# EAGLE board Ambisonic Clock Decoder With Phase Shifted Crosstalk Cancellation (EAGLE 9.0.1), part 1 of 2
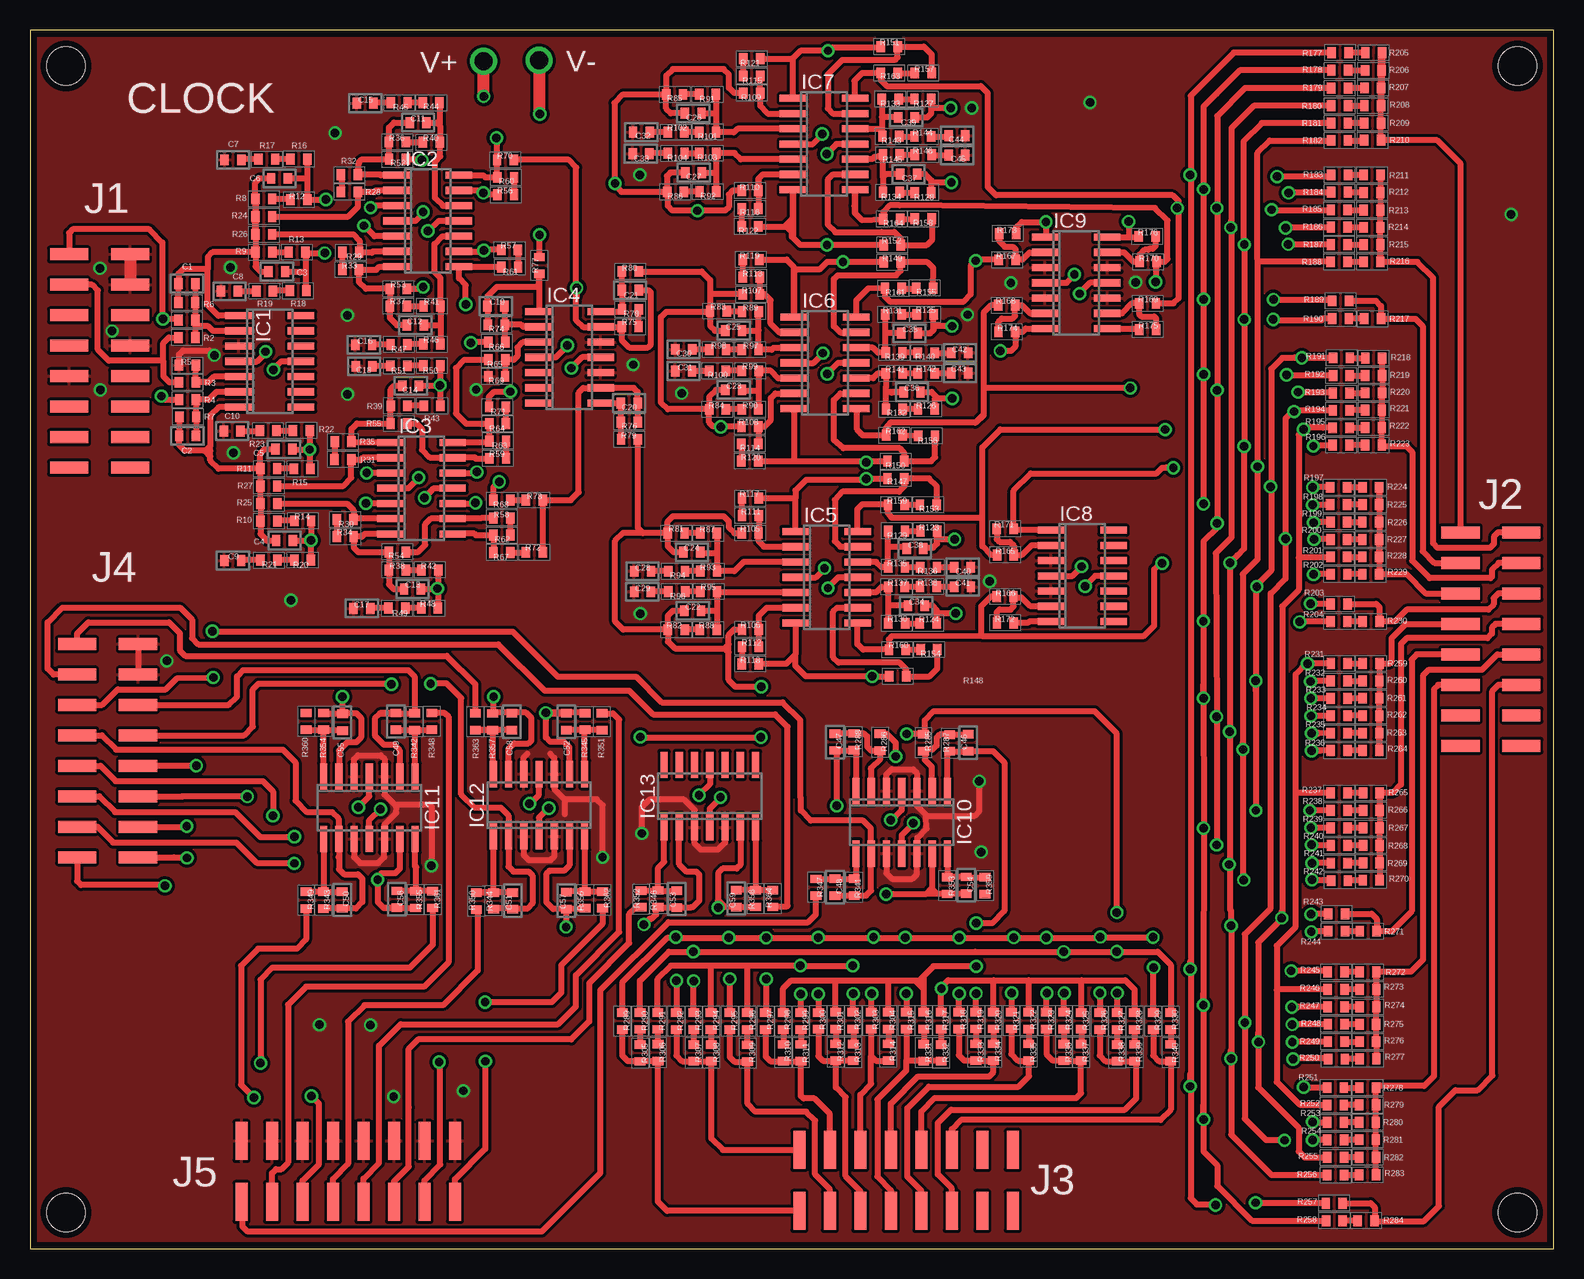
[diagram p5: board, top side]
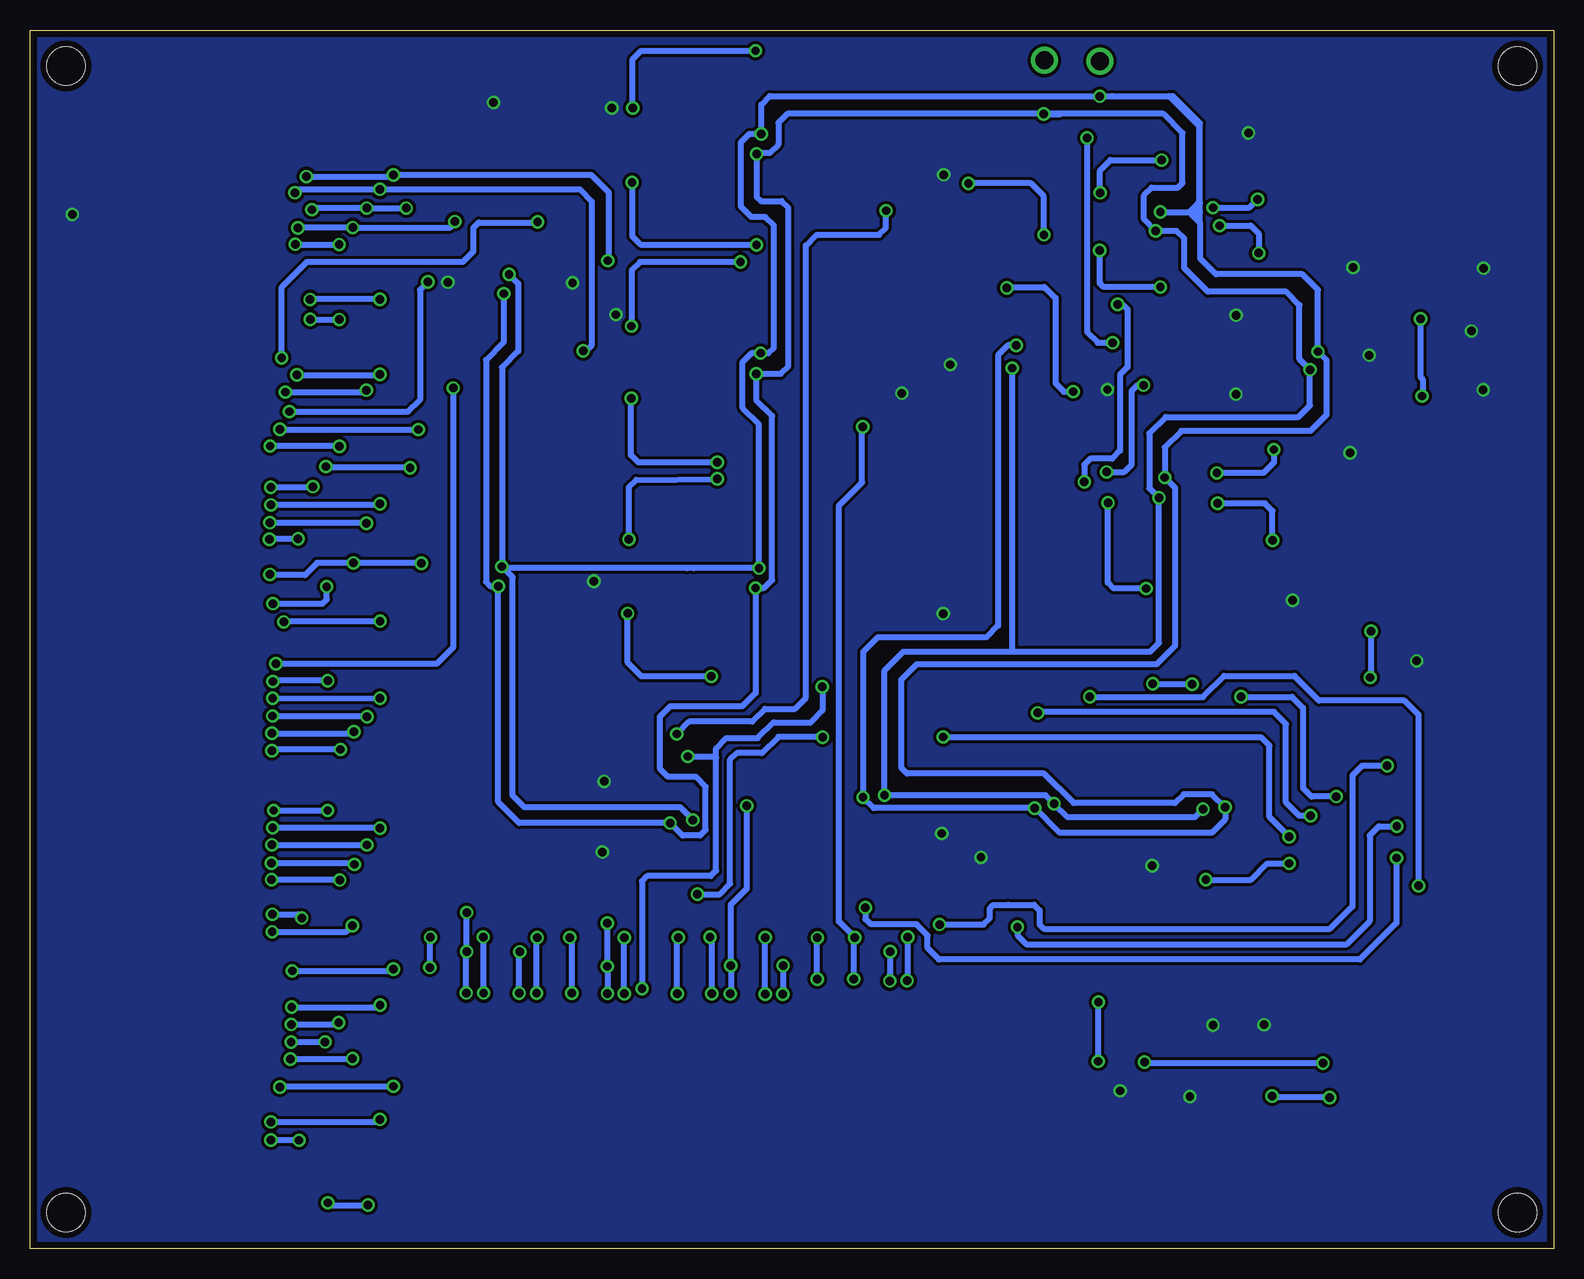
[diagram p6: board, bottom side, seen from below]

Size 127 x 101.6 mm. Coordinates in mm from the lower left corner, seen from the top.
Outline: 0,0 127,0 127,101.6 0,101.6 0,0
Copper layers (1*16): Top 0.035mm / dielectric 1.5mm / Bottom 0.035mm
Design rules "default *": minimum track width 6mil, minimum drill 0.35mm, track to track 10mil, track to pad 15mil, pad to pad 15mil, via to via 10mil, smd to smd 6mil, copper to edge 20mil, drill to drill 10mil, minimum pad ring 10mil, minimum via ring 8mil, stop-mask expansion 4mil, vias tented up to drill 0mil, thermal gap 10mil
Holes 3.2 mm at 3,98.6 124,98.6 3,3 124,3

## Footprints (pad centres in the part's own frame; a part is rotated, then mirrored left to right if it is on the bottom)
CT6032 = smd 0.7 x 0.9: + -0.7,0; - 0.7,0
SO14 = smd 0.6 x 2.2: 1 -3.81,-2.6; 2 -2.54,-2.6; 3 -1.27,-2.6; 4 0,-2.6; 5 1.27,-2.6; 6 2.54,-2.6; 7 3.81,-2.6; 8 3.81,2.6; 9 2.54,2.6; 10 1.27,2.6; 11 0,2.6; 12 -1.27,2.6; 13 -2.54,2.6; 14 -3.81,2.6
2X08SMT = smd 1 x 3.17: 1 -8.89,-2.54; 2 -8.89,2.54; 3 -6.35,-2.54; 4 -6.35,2.54; 5 -3.81,-2.54; 6 -3.81,2.54; 7 -1.27,-2.54; 8 -1.27,2.54; 9 1.27,-2.54; 10 1.27,2.54; 11 3.81,-2.54; 12 3.81,2.54; 13 6.35,-2.54; 14 6.35,2.54; 15 8.89,-2.54; 16 8.89,2.54
R6332W = smd 0.7 x 0.9: 1 -0.7,0; 2 0.7,0

## Placement (x,y rotation side)
C1  18PF  [CT6032]  13.09,80.46 180 top
C2  18PF  [CT6032]  13.14,67.77 180 top
C3  100NF  [CT6032]  20.57,81.45 0 top
C4  100NF  [CT6032]  21.22,59.03 0 top
C5  100NF  [CT6032]  21.16,66.65 0 top
C6  100NF  [CT6032]  20.8,89.23 0 top
C7  100NF  [CT6032]  16.92,90.77 0 top
C8  100NF  [CT6032]  16.63,79.82 0 top
C9  100NF  [CT6032]  16.9,57.37 0 top
C10  100NF  [CT6032]  16.85,68.16 0 top
C11  4.7NF  [CT6032]  32.35,93.88 0 top
C12  4.7NF  [CT6032]  32.12,76.99 0 top
C13  4.7NF  [CT6032]  31.89,54.99 0 top
C14  4.7NF  [CT6032]  31.73,71.94 0 top
C15  4.7NF  [CT6032]  27.94,95.49 0 top
C16  4.7NF  [CT6032]  27.82,75.35 0 top
C17  4.7NF  [CT6032]  27.66,53.38 0 top
C18  4.7NF  [CT6032]  27.85,73.56 0 top
C19  18PF  [CT6032]  38.84,78.58 180 top
C20  18PF  [CT6032]  49.95,70.49 180 top
C21  18PF  [CT6032]  50.04,79.9 180 top
C22  100NF  [CT6032]  55.24,53.19 0 top
C23  100NF  [CT6032]  58.65,71.6 0 top
C24  100NF  [CT6032]  55.17,58.07 0 top
C25  100NF  [CT6032]  58.65,76.53 0 top
C26  100NF  [CT6032]  55.28,94.65 0 top
C27  100NF  [CT6032]  55.31,89.71 0 top
C28  100NF  [CT6032]  51.07,56.48 180 top
C29  100NF  [CT6032]  51.06,54.77 180 top
C30  100NF  [CT6032]  54.5,74.97 180 top
C31  100NF  [CT6032]  54.49,73.17 180 top
C32  100NF  [CT6032]  50.97,93.08 180 top
C33  100NF  [CT6032]  50.94,91.28 180 top
C34  4.7NF  [CT6032]  73.89,53.6 180 top
C35  4.7NF  [CT6032]  73.32,76.32 180 top
C36  4.7NF  [CT6032]  73.53,71.42 180 top
C37  4.7NF  [CT6032]  73.25,89.58 180 top
C38  4.7NF  [CT6032]  73.77,58.37 180 top
C39  4.7NF  [CT6032]  73.06,94.31 180 top
C40  4.7NF  [CT6032]  77.73,56.81 0 top
C41  4.7NF  [CT6032]  77.74,55.18 0 top
C42  4.7NF  [CT6032]  77.5,74.69 0 top
C43  4.7NF  [CT6032]  77.5,72.99 0 top
C44  4.7NF  [CT6032]  77.27,92.79 0 top
C45  4.7NF  [CT6032]  77.27,91.16 0 top
C46  18PF  [CT6032]  78.2,42.19 270 top
C47  18PF  [CT6032]  67.11,42.24 270 top
C48  18PF  [CT6032]  67.11,30.14 90 top
C49  18PF  [CT6032]  30.5,43.96 270 top
C50  18PF  [CT6032]  26.03,29.07 90 top
C51  18PF  [CT6032]  40.24,29 90 top
C52  18PF  [CT6032]  44.7,43.94 270 top
C53  18PF  [CT6032]  53.92,29.15 90 top
C54  18PF  [CT6032]  78.04,30.3 90 top
C55  18PF  [CT6032]  26.05,43.89 270 top
C56  18PF  [CT6032]  30.58,29.13 90 top
C57  18PF  [CT6032]  44.7,29.01 90 top
C58  18PF  [CT6032]  40.17,43.94 270 top
C59  18PF  [CT6032]  58.88,29.19 90 top
IC1  TL074D  [SO14]  19.99,73.97 270 top
IC2  TL074D  [SO14]  33.15,85.68 270 top
IC3  TL074D  [SO14]  32.63,63.4 270 top
IC4  TL074D  [SO14]  44.97,74.31 270 top
IC5  TL074D  [SO14]  66.41,55.97 270 top
IC6  TL074D  [SO14]  66.27,73.85 270 top
IC7  TL074D  [SO14]  66.19,92.09 270 top
IC8  TL074D  [SO14]  87.72,56.09 270 top
IC9  TL074D  [SO14]  87.2,80.52 270 top
IC10  TL074D  [SO14]  72.66,35.55 180 top
IC11  TL074D  [SO14]  28.29,36.76 180 top
IC12  TL074D  [SO14]  42.43,36.97 0 top
IC13  TL074D  [SO14]  56.67,37.73 0 top
J1  CON_16  [2X08SMT]  5.8,74.01 270 top
J2  CON_16  [2X08SMT]  121.79,50.82 270 top
J3  CON_16  [2X08SMT]  73.03,5.69 0 top
J4  CON_16  [2X08SMT]  6.46,41.52 270 top
J5  CON_16  [2X08SMT]  26.53,6.44 0 top
R1  10K  [R6332W]  13.08,77.42 0 top
R2  10K  [R6332W]  13.08,75.96 0 top
R3  10K  [R6332W]  13.13,72.23 0 top
R4  10K  [R6332W]  13.14,70.78 0 top
R5  R  [R6332W]  13.13,73.65 0 top
R6  10K  [R6332W]  13.07,78.87 180 top
R7  10K  [R6332W]  13.15,69.35 180 top
R8  R  [R6332W]  19.49,87.52 0 top
R9  R  [R6332W]  19.5,83.07 0 top
R10  R  [R6332W]  19.91,60.66 0 top
R11  10K  [R6332W]  19.9,65.03 0 top
R12  R  [R6332W]  22.41,87.45 0 top
R13  R  [R6332W]  22.26,83.08 0 top
R14  R  [R6332W]  22.74,60.69 0 top
R15  470R  [R6332W]  22.69,65.01 0 top
R16  22K  [R6332W]  22.41,90.84 0 top
R17  100R  [R6332W]  19.74,90.82 180 top
R18  8.2K  [R6332W]  22.35,79.86 0 top
R19  1.2K  [R6332W]  19.56,79.83 180 top
R20  22K  [R6332W]  22.73,57.41 0 top
R21  100R  [R6332W]  19.91,57.4 180 top
R22  8.2K  [R6332W]  22.63,68.21 0 top
R23  1.2K  [R6332W]  19.85,68.2 180 top
R24  10K  [R6332W]  19.49,86.05 0 top
R25  10K  [R6332W]  19.91,62.12 0 top
R26  10K  [R6332W]  19.49,84.56 0 top
R27  10K  [R6332W]  19.9,63.58 0 top
R28  39K  [R6332W]  26.63,88.1 180 top
R29  47K  [R6332W]  26.74,83.07 180 top
R30  39K  [R6332W]  26.27,60.79 180 top
R31  47K  [R6332W]  26.09,65.8 180 top
R32  390R  [R6332W]  26.63,89.53 0 top
R33  1K  [R6332W]  26.73,81.62 0 top
R34  390R  [R6332W]  26.28,59.36 0 top
R35  1K  [R6332W]  26.1,67.28 0 top
R36  6.8K  [R6332W]  30.63,92.26 0 top
R37  4.7K  [R6332W]  30.71,78.58 0 top
R38  6.8K  [R6332W]  30.63,56.59 0 top
R39  4.7K  [R6332W]  30.77,70.26 0 top
R40  5.1K  [R6332W]  33.46,92.24 0 top
R41  390R  [R6332W]  33.51,78.58 0 top
R42  5.1K  [R6332W]  33.33,56.59 0 top
R43  390R  [R6332W]  33.52,70.27 0 top
R44  10K  [R6332W]  33.44,95.53 0 top
R45  560R  [R6332W]  30.78,95.53 180 top
R46  2.2K  [R6332W]  33.5,75.4 0 top
R47  180R  [R6332W]  30.76,75.38 180 top
R48  10K  [R6332W]  33.31,53.4 0 top
R49  560R  [R6332W]  30.59,53.4 180 top
R50  2.2k  [R6332W]  33.5,73.62 0 top
R51  180R  [R6332W]  30.75,73.6 180 top
R52  10K  [R6332W]  30.64,90.82 0 top
R53  10K  [R6332W]  30.71,80.02 0 top
R54  10K  [R6332W]  30.63,58.09 0 top
R55  10K  [R6332W]  30.76,68.79 0 top
R56  47K  [R6332W]  39.65,87.86 0 top
R57  39K  [R6332W]  39.98,83.27 0 top
R58  47K  [R6332W]  39.33,60.92 0 top
R59  39K  [R6332W]  38.99,65.89 0 top
R60  820R  [R6332W]  39.65,89.31 180 top
R61  390R  [R6332W]  39.99,81.83 180 top
R62  820R  [R6332W]  39.33,59.49 180 top
R63  360R  [R6332W]  38.99,67.34 180 top
R64  5.6K  [R6332W]  38.98,68.78 0 top
R65  10K  [R6332W]  38.91,74.13 0 top
R66  24K  [R6332W]  38.91,75.57 0 top
R67  560R  [R6332W]  39.34,58.05 0 top
R68  6.8K  [R6332W]  39.33,62.4 0 top
R69  15K  [R6332W]  38.9,72.72 0 top
R70  10K  [R6332W]  39.64,90.77 0 top
R71  56K  [R6332W]  38.97,70.19 180 top
R72  12K  [R6332W]  42.04,58.06 0 top
R73  47K  [R6332W]  42.04,62.41 0 top
R74  10K  [R6332W]  38.88,77.02 180 top
R75  4.7K  [R6332W]  50.03,76.86 0 top
R76  10K  [R6332W]  49.96,68.92 180 top
R77  47R  [R6332W]  42.45,81.96 90 top
R78  270R  [R6332W]  50.05,78.31 180 top
R79  47R  [R6332W]  49.97,67.47 0 top
R80  47R  [R6332W]  50.04,81.47 0 top
R81  47K  [R6332W]  53.86,59.65 0 top
R82  10K  [R6332W]  53.88,51.6 0 top
R83  47K  [R6332W]  57.39,78.16 0 top
R84  10K  [R6332W]  57.31,69.98 0 top
R85  47K  [R6332W]  53.74,96.23 0 top
R86  10K  [R6332W]  53.81,88.1 0 top
R87  220R  [R6332W]  56.56,59.65 0 top
R88  470R  [R6332W]  56.54,51.6 0 top
R89  220R  [R6332W]  60.05,78.13 0 top
R90  470R  [R6332W]  60.02,69.98 0 top
R91  220R  [R6332W]  56.48,96.24 0 top
R92  470R  [R6332W]  56.51,88.12 0 top
R93  47K  [R6332W]  56.57,56.49 0 top
R94  22K  [R6332W]  53.9,56.48 180 top
R95  8.2K  [R6332W]  56.57,54.79 0 top
R96  1.2K  [R6332W]  53.91,54.79 180 top
R97  47K  [R6332W]  60.03,74.95 0 top
R98  22K  [R6332W]  57.32,74.95 180 top
R99  8.2K  [R6332W]  60.04,73.19 0 top
R100  1.2K  [R6332W]  57.31,73.18 180 top
R101  47K  [R6332W]  56.49,93.09 0 top
R102  22K  [R6332W]  53.85,93.08 180 top
R103  8.2K  [R6332W]  56.5,91.33 0 top
R104  1.2K  [R6332W]  53.86,91.32 180 top
R105  10K  [R6332W]  60.03,59.66 0 top
R106  10K  [R6332W]  60.05,51.63 0 top
R107  10K  [R6332W]  60.12,79.56 0 top
R108  10K  [R6332W]  60.01,68.54 0 top
R109  10K  [R6332W]  60.16,96.34 0 top
R110  10K  [R6332W]  60.02,88.21 0 top
R111  39K  [R6332W]  60.05,61.12 180 top
R112  47K  [R6332W]  60.05,50.19 180 top
R113  39K  [R6332W]  60.13,81 180 top
R114  47K  [R6332W]  60,67.1 180 top
R115  39K  [R6332W]  60.16,97.77 180 top
R116  47K  [R6332W]  60.02,86.71 180 top
R117  390R  [R6332W]  60.05,62.57 0 top
R118  1K  [R6332W]  60.04,48.75 0 top
R119  390R  [R6332W]  60.1,82.46 0 top
R120  1K  [R6332W]  60,65.66 0 top
R121  390R  [R6332W]  60.16,99.2 0 top
R122  1K  [R6332W]  60.02,85.22 0 top
R123  6.8K  [R6332W]  74.93,59.84 180 top
R124  4.7K  [R6332W]  74.87,52.14 180 top
R125  6.8K  [R6332W]  74.62,77.89 180 top
R126  4.7K  [R6332W]  74.72,70 180 top
R127  6.8K  [R6332W]  74.43,95.85 180 top
R128  4.7K  [R6332W]  74.44,88.05 180 top
R129  5.1K  [R6332W]  72.24,59.84 180 top
R130  390R  [R6332W]  72.25,52.14 180 top
R131  5.1K  [R6332W]  71.98,77.89 180 top
R132  390R  [R6332W]  72.05,69.99 180 top
R133  5.1K  [R6332W]  71.7,95.84 180 top
R134  390R  [R6332W]  71.8,88.07 180 top
R135  10K  [R6332W]  72.24,56.81 180 top
R136  560R  [R6332W]  74.9,56.81 0 top
R137  2.2K  [R6332W]  72.23,55.18 180 top
R138  180R  [R6332W]  74.89,55.2 0 top
R139  10K  [R6332W]  72.03,74.7 180 top
R140  560R  [R6332W]  74.7,74.68 0 top
R141  2.2K  [R6332W]  72.04,72.98 180 top
R142  180R  [R6332W]  74.7,72.98 0 top
R143  10K  [R6332W]  71.76,92.74 180 top
R144  560R  [R6332W]  74.43,92.72 0 top
R145  2.2K  [R6332W]  71.8,91.2 180 top
R146  180R  [R6332W]  74.45,91.2 0 top
R147  10K  [R6332W]  72.18,64.21 0 top
R148  10K  [R6332W]  72.33,47.72 0 top
R149  10K  [R6332W]  71.88,82.24 0 top
R150  10K  [R6332W]  72.18,65.65 0 top
R151  10K  [R6332W]  71.62,100.21 0 top
R152  10K  [R6332W]  71.87,83.67 0 top
R153  47K  [R6332W]  74.89,62.02 180 top
R154  39K  [R6332W]  74.94,49.95 180 top
R155  47K  [R6332W]  74.59,80.09 180 top
R156  39K  [R6332W]  74.74,67.76 180 top
R157  47K  [R6332W]  74.46,98.02 180 top
R158  39K  [R6332W]  74.46,85.86 180 top
R159  820R  [R6332W]  72.22,62.02 180 top
R160  390R  [R6332W]  72.3,49.94 180 top
R161  820R  [R6332W]  71.97,80.07 180 top
R162  390R  [R6332W]  72.06,67.82 180 top
R163  820R  [R6332W]  71.62,98.01 180 top
R164  390R  [R6332W]  71.83,85.84 180 top
R165  10K  [R6332W]  81.31,57.84 0 top
R166  10K  [R6332W]  81.28,54.37 0 top
R167  10K  [R6332W]  81.45,82.44 0 top
R168  10K  [R6332W]  81.41,78.65 0 top
R169  10K  [R6332W]  93.15,78.81 180 top
R170  10K  [R6332W]  93.21,82.28 180 top
R171  10K  [R6332W]  81.29,60.01 0 top
R172  10K  [R6332W]  81.3,52.17 0 top
R173  10K  [R6332W]  81.5,84.63 0 top
R174  10K  [R6332W]  81.43,76.44 0 top
R175  10K  [R6332W]  93.17,76.63 180 top
R176  10K  [R6332W]  93.13,84.39 180 top
R177  15K  [R6332W]  109.21,99.71 0 top
R178  100K  [R6332W]  109.18,98.24 0 top
R179  180K  [R6332W]  109.16,96.75 0 top
R180  270K  [R6332W]  109.16,95.28 0 top
R181  560K  [R6332W]  109.15,93.83 0 top
R182  270K  [R6332W]  109.15,92.39 0 top
R183  100K  [R6332W]  109.16,89.52 0 top
R184  15K  [R6332W]  109.15,88.07 0 top
R185  560K  [R6332W]  109.14,86.6 0 top
R186  270K  [R6332W]  109.14,85.15 0 top
R187  180K  [R6332W]  109.14,83.71 0 top
R188  270K  [R6332W]  109.13,82.27 0 top
R189  100K  [R6332W]  109.25,79.02 0 top
R190  120K  [R6332W]  109.24,77.54 0 top
R191  100K  [R6332W]  109.32,74.26 0 top
R192  15K  [R6332W]  109.31,72.79 0 top
R193  560K  [R6332W]  109.3,71.33 0 top
R194  270K  [R6332W]  109.3,69.89 0 top
R195  270K  [R6332W]  109.29,68.44 0 top
R196  180K  [R6332W]  109.28,67 0 top
R197  15K  [R6332W]  109.09,63.48 0 top
R198  100K  [R6332W]  109.08,62.03 0 top
R199  180K  [R6332W]  109.1,60.58 0 top
R200  270K  [R6332W]  109.1,59.12 0 top
R201  270K  [R6332W]  109.1,57.68 0 top
R202  560K  [R6332W]  109.11,56.23 0 top
R203  100K  [R6332W]  109.12,53.75 0 top
R204  120K  [R6332W]  109.11,52.29 0 top
R205  100K  [R6332W]  112.01,99.7 0 top
R206  100K  [R6332W]  111.98,98.22 0 top
R207  8.2K  [R6332W]  111.94,96.76 0 top
R208  46K  [R6332W]  111.93,95.29 0 top
R209  4.7K  [R6332W]  111.92,93.83 0 top
R210  56K  [R6332W]  111.91,92.4 0 top
R211  100K  [R6332W]  111.87,89.52 0 top
R212  100K  [R6332W]  111.86,88.05 0 top
R213  4.7K  [R6332W]  111.86,86.59 0 top
R214  56K  [R6332W]  111.86,85.14 0 top
R215  8.2K  [R6332W]  111.86,83.7 0 top
R216  56K  [R6332W]  111.86,82.26 0 top
R217  22K  [R6332W]  111.91,77.53 0 top
R218  100K  [R6332W]  112.01,74.25 0 top
R219  100K  [R6332W]  112,72.8 0 top
R220  4.7K  [R6332W]  112,71.35 0 top
R221  56K  [R6332W]  111.99,69.91 0 top
R222  56K  [R6332W]  111.99,68.45 0 top
R223  8.2K  [R6332W]  111.99,67 0 top
R224  100K  [R6332W]  111.77,63.48 0 top
R225  100K  [R6332W]  111.77,62.03 0 top
R226  4.7K  [R6332W]  111.76,60.57 0 top
R227  56K  [R6332W]  111.76,59.12 0 top
R228  56K  [R6332W]  111.76,57.68 0 top
R229  4.7K  [R6332W]  111.76,56.23 0 top
R230  22K  [R6332W]  111.79,52.29 0 top
R231  15K  [R6332W]  109.14,48.79 0 top
R232  100K  [R6332W]  109.13,47.33 0 top
R233  180K  [R6332W]  109.12,45.88 0 top
R234  270K  [R6332W]  109.12,44.44 0 top
R235  560K  [R6332W]  109.12,42.97 0 top
R236  270K  [R6332W]  109.12,41.53 0 top
R237  100K  [R6332W]  109.13,37.99 0 top
R238  15K  [R6332W]  109.13,36.53 0 top
R239  560K  [R6332W]  109.13,35.07 0 top
R240  270K  [R6332W]  109.14,33.61 0 top
R241  180K  [R6332W]  109.14,32.15 0 top
R242  270K  [R6332W]  109.15,30.69 0 top
R243  100K  [R6332W]  108.91,27.92 0 top
R244  120K  [R6332W]  108.91,26.47 0 top
R245  100K  [R6332W]  108.88,23.08 0 top
R246  15K  [R6332W]  108.88,21.62 0 top
R247  560K  [R6332W]  108.88,20.17 0 top
R248  270K  [R6332W]  108.89,18.72 0 top
R249  270K  [R6332W]  108.89,17.26 0 top
R250  180K  [R6332W]  108.9,15.81 0 top
R251  15K  [R6332W]  108.82,13.43 0 top
R252  100K  [R6332W]  108.82,11.98 0 top
R253  180K  [R6332W]  108.82,10.53 0 top
R254  270K  [R6332W]  108.83,9.08 0 top
R255  270K  [R6332W]  108.83,7.61 0 top
R256  560K  [R6332W]  108.83,6.15 0 top
R257  100K  [R6332W]  108.72,3.8 0 top
R258  120K  [R6332W]  108.73,2.34 0 top
R259  100K  [R6332W]  111.79,48.79 0 top
R260  100K  [R6332W]  111.78,47.34 0 top
R261  8.2K  [R6332W]  111.78,45.89 0 top
R262  46K  [R6332W]  111.78,44.44 0 top
R263  4.7K  [R6332W]  111.78,42.98 0 top
R264  56K  [R6332W]  111.78,41.53 0 top
R265  100K  [R6332W]  111.81,38 0 top
R266  100K  [R6332W]  111.81,36.55 0 top
R267  4.7K  [R6332W]  111.81,35.07 0 top
R268  56K  [R6332W]  111.81,33.62 0 top
R269  8.2K  [R6332W]  111.81,32.17 0 top
R270  56K  [R6332W]  111.8,30.72 0 top
R271  22K  [R6332W]  111.55,26.47 0 top
R272  100K  [R6332W]  111.53,23.07 0 top
R273  100K  [R6332W]  111.53,21.62 0 top
R274  4.7K  [R6332W]  111.53,20.16 0 top
R275  56K  [R6332W]  111.52,18.71 0 top
R276  56K  [R6332W]  111.52,17.26 0 top
R277  8.2K  [R6332W]  111.53,15.82 0 top
R278  100K  [R6332W]  111.51,13.44 0 top
R279  100K  [R6332W]  111.5,11.99 0 top
R280  4.7K  [R6332W]  111.49,10.55 0 top
R281  56K  [R6332W]  111.49,9.1 0 top
R282  56K  [R6332W]  111.5,7.63 0 top
R283  4.7K  [R6332W]  111.5,6.16 0 top
R284  22K  [R6332W]  111.38,2.34 0 top
R285  100K  [R6332W]  74.48,42.19 270 top
R286  100K  [R6332W]  70.86,42.22 270 top
R287  100K  [R6332W]  76.67,42.16 270 top
R288  100K  [R6332W]  68.69,42.25 270 top
R289  100K  [R6332W]  49.37,18.98 270 top
R290  150K  [R6332W]  50.85,18.99 270 top
R291  270K  [R6332W]  52.33,18.99 270 top
R292  100K  [R6332W]  53.88,18.97 270 top
R293  270K  [R6332W]  55.33,18.97 270 top
R294  150K  [R6332W]  56.78,18.97 270 top
R295  100K  [R6332W]  58.33,18.97 270 top
R296  120K  [R6332W]  59.81,18.97 270 top
R297  100K  [R6332W]  61.32,18.98 270 top
R298  270K  [R6332W]  62.79,18.98 270 top
R299  150K  [R6332W]  64.26,18.98 270 top
R300  100K  [R6332W]  65.72,19 270 top
R301  150K  [R6332W]  67.16,19.02 270 top
R302  270K  [R6332W]  68.61,19.01 270 top
R303  100K  [R6332W]  70.12,19.02 270 top
R304  120K  [R6332W]  71.55,19.02 270 top
R305  13K  [R6332W]  50.86,16.32 270 top
R306  13K  [R6332W]  52.35,16.35 270 top
R307  13K  [R6332W]  55.33,16.33 270 top
R308  13K  [R6332W]  56.79,16.33 270 top
R309  22K  [R6332W]  59.82,16.3 270 top
R310  13K  [R6332W]  62.8,16.34 270 top
R311  13K  [R6332W]  64.27,16.34 270 top
R312  13K  [R6332W]  67.17,16.38 270 top
R313  13K  [R6332W]  68.63,16.37 270 top
R314  22K  [R6332W]  71.55,16.38 270 top
R315  100K  [R6332W]  73.06,19.01 270 top
R316  150K  [R6332W]  74.5,19.01 270 top
R317  270K  [R6332W]  75.95,19.01 270 top
R318  100K  [R6332W]  77.43,19.02 270 top
R319  270K  [R6332W]  78.86,19.03 270 top
R320  150K  [R6332W]  80.31,19.03 270 top
R321  100K  [R6332W]  81.81,19.03 270 top
R322  120K  [R6332W]  83.25,19.02 270 top
R323  100K  [R6332W]  84.74,19.02 270 top
R324  270K  [R6332W]  86.19,19.01 270 top
R325  150K  [R6332W]  87.63,19 270 top
R326  100K  [R6332W]  89.18,18.98 270 top
R327  150K  [R6332W]  90.62,18.97 270 top
R328  270K  [R6332W]  92.07,18.98 270 top
R329  100K  [R6332W]  93.64,18.97 270 top
R330  120K  [R6332W]  95.09,18.97 270 top
R331  13K  [R6332W]  74.5,16.35 270 top
R332  13K  [R6332W]  75.95,16.33 270 top
R333  13K  [R6332W]  78.86,16.38 270 top
R334  13K  [R6332W]  80.31,16.38 270 top
R335  22K  [R6332W]  83.25,16.38 270 top
R336  13K  [R6332W]  86.19,16.37 270 top
R337  13K  [R6332W]  87.62,16.37 270 top
R338  13K  [R6332W]  90.63,16.33 270 top
R339  13K  [R6332W]  92.08,16.34 270 top
R340  22K  [R6332W]  95.09,16.34 270 top
R341  100K  [R6332W]  68.7,30.14 90 top
R342  100K  [R6332W]  32.06,43.94 270 top
R343  100K  [R6332W]  24.45,29.06 90 top
R344  100K  [R6332W]  38.64,29 90 top
R345  100K  [R6332W]  46.26,43.95 270 top
R346  100K  [R6332W]  52.36,29.17 90 top
R347  47R  [R6332W]  65.52,30.13 270 top
R348  47R  [R6332W]  33.5,43.96 90 top
R349  47R  [R6332W]  23.02,29.06 270 top
R350  47R  [R6332W]  37.2,28.98 270 top
R351  47R  [R6332W]  47.68,43.94 90 top
R352  47R  [R6332W]  50.94,29.16 270 top
R353  100K  [R6332W]  76.45,30.28 90 top
R354  100K  [R6332W]  24.47,43.96 270 top
R355  100K  [R6332W]  32.15,29.11 90 top
R356  100K  [R6332W]  46.28,29.08 90 top
R357  100K  [R6332W]  38.57,43.92 270 top
R358  100K  [R6332W]  60.48,29.2 90 top
R359  47R  [R6332W]  79.61,30.27 270 top
R360  47R  [R6332W]  23.03,43.96 90 top
R361  47R  [R6332W]  33.57,29.11 270 top
R362  47R  [R6332W]  47.72,29.08 270 top
R363  47R  [R6332W]  37.13,43.94 90 top
R364  47R  [R6332W]  61.92,29.2 270 top

## Tracks (layer width: path | path; a pad name or v marks a point on that pad's centre or on a via)
01CLK
  Top 0.5: R347.2 65.52,27.87 64.87,27.22 53.21,27.22 47.55,21.56 47.55,6.32 42.65,1.42 18.15,1.42 17.72,1.85 17.72,3.82 J5.1
01CLK_NRM
  Top 0.5: R289.2 49.37,16.11 49.83,15.65 50.83,15.65 | 50.83,15.65 R306.2 52.35,3.92 53.12,3.15 J3.1 | 50.83,15.65 R305.2
01CLK_PS
  Top 0.5: J2.1 119.25,90.45 117.3,92.4 R210.2 | R210.2 112.61,99.6 R205.2 112.71,98.25 R206.2 112.68,96.8 R207.2 R208.2 | R210.2 R209.2
01CLK_SUM  (via drill 0.7)
  Top 0.5: C48.+ R341.1 69.7,29.44 70.12,29.86 IC10.9 70.08,32.99 70.08,35.06 69.44,35.7 65.07,35.7 64.25,36.52 64.25,37.62 64.22,37.65 64.22,44.07 62.73,45.55 52.65,45.55 50.51,47.7 43.99,47.7 40.25,51.44 36.34,51.44 v15.22,51.47 v15.21,51.48 | J4.5 6.02,45.33 7.33,46.64 11.32,46.64 12.21,47.53 15.23,47.56 15.23,47.57 v15.28,47.62
  Bottom 0.5: v15.21,51.48 15.21,47.69 v15.28,47.62
02CLK
  Top 0.5: J5.3 20.18,6.3 20.51,6.63 20.96,6.63 21.5,7.17 21.5,20.34 23,21.84 32.85,21.84 34.88,23.86 34.88,44.35 34.57,44.66 R348.2
02CLK_NRM
  Top 0.5: R292.2 53.88,16.11 54.36,15.63 R307.2 R308.2 56.79,9.2 57.76,8.23 J3.2
02CLK_PS
  Top 0.5: J2.2 122.37,59.71 122.03,59.37 122.03,58.76 121.7,58.43 117.33,58.43 116.96,58.8 116.96,80.95 115.65,82.26 R216.2 | R211.2 R212.2 | R212.2 R213.2 | R213.2 112.57,83.76 112.56,83.75 R216.2 | R212.2 | 112.57,86.56 R213.2 | R214.2 R213.2 | R215.2 R216.2
02CLK_SUM
  Top 0.5: 29.18,44.64 R342.1 32.06,47.72 31.54,48.24 17.77,48.24 17.25,47.72 17.25,46 16.58,45.33 J4.6 | 29.18,44.64 28.73,44.19 28.73,42.79 29.49,42.03 30.33,42.03 30.8,41.56 30.8,39.39 IC11.2 | C49.+ 29.2,44.66 29.18,44.64
03CLK  (via drill 0.7)
  Top 0.5: J5.5 22.72,5.67 24.1,7.05 24.1,12.1 23.48,12.72 v23.46,12.72 v23.45,12.73 | v18.66,12.61 17.6,13.67 17.6,23.59 19.01,25 22.25,25 23.02,25.77 R349.2
  Bottom 0.5: v18.66,12.61 23.33,12.61 v23.45,12.73
03CLK_NRM
  Top 0.5: R295.2 58.33,15.98 58.71,15.6 R309.2 59.82,12.06 60.45,11.43 64.7,11.43 65.44,10.69 65.44,6.19 66.68,4.95 J3.3
03CLK_PS
  Top 0.5: J2.3 117.07,57.17 116.09,58.15 116.09,76.93 115.49,77.53 R217.2 112.61,78.6 112.19,79.02 R189.2
03CLK_SUM
  Top 0.5: 25.72,32.65 25.75,32.62 | R343.1 C50.+ 27.17,28.37 27.7,28.9 27.7,30.86 27.35,31.21 26.18,31.21 25.75,31.64 25.75,32.62 | J4.7 5.99,42.79 7.18,41.6 21.07,41.6 22.13,40.54 22.13,37.37 23.11,36.39 25.19,36.39 25.72,35.86 25.72,34.19 IC11.9 25.75,32.62
04CLK
  Top 0.5: J5.7 25.26,5.8 26.52,7.06 26.52,18.94 27.88,20.3 34.42,20.3 37.32,23.2 37.32,28.16 R350.2
04CLK_NRM
  Top 0.5: R297.2 61.32,16.03 61.71,15.64 R310.2 R311.2 64.27,12.74 64.48,12.53 65.38,12.53 66.68,11.23 J3.4
04CLK_PS
  Top 0.5: J2.4 122.42,57.17 121.86,56.61 121.86,56.03 121.73,55.9 116.68,55.9 115.22,57.36 115.22,66.43 114.73,66.92 112.77,66.92 R223.2 112.69,68.42 | R220.2 112.71,68.44 112.69,68.42 | R219.2 R218.2 | R221.2 R220.2 112.71,71.37 | R219.2 | R219.2 112.71,71.37 | R220.2 | R220.2 112.71,71.37 | R222.2 112.69,68.42
04CLK_SUM  (via drill 0.7)
  Top 0.5: 40.33,28.39 38.73,28.39 R344.1 | J4.8 17.84,42.79 18.58,43.53 18.58,46.64 19.05,47.11 29.93,47.11 29.99,47.05 v30.12,47.05 | v33.4,47.1 v33.41,47.1 33.47,47.16 34.69,47.16 35.95,45.9 35.95,37.89 37.09,36.75 39.25,36.75 39.89,36.11 IC12.2 39.89,31.86 40.31,31.44 41.55,31.44 41.88,31.11 41.88,28.77 41.5,28.39 40.33,28.39 | C51.+ 40.33,28.39
  Bottom 0.5: v30.12,47.05 33.35,47.05 v33.4,47.1
05CLK
  Top 0.5: J5.9 27.8,5.85 29.1,7.15 29.1,16.92 30.9,18.72 44.04,18.72 45.51,20.19 45.51,22.8 49.12,26.41 49.12,44.12 48.6,44.64 R351.2
05CLK_NRM
  Top 0.5: J3.5 69.22,4.8 67.98,6.04 67.98,12.63 67.17,13.44 R312.2 | R313.2 R312.2 | R300.2 65.72,16.05 66.1,15.67 R312.2
05CLK_PS
  Top 0.5: J2.5 116.35,54.63 114.75,56.23 R229.2 R227.2 | R227.2 R224.2 R225.2 R226.2 R227.2 | R228.2 R227.2
05CLK_SUM  (via drill 0.7)
  Top 0.5: 43.31,44.73 43.01,44.43 43.01,42.61 43.37,42.25 44.52,42.25 44.97,41.8 IC12.9 | 43.31,44.73 46.18,44.73 R345.1 | 43.31,44.73 43.4,44.64 C52.+ | J4.9 5.88,40.25 7.14,38.99 19.4,38.99 20.25,38.14 v20.25,36.09 20.25,36.03 20.22,36 | v43,44.67 43.06,44.73 43.31,44.73
  Bottom 0.5: v20.25,36.09 21.19,36.09 22.3,37.2 22.3,43.74 23.31,44.75 43.08,44.75 | 43.26,44.67 43.18,44.75 43.08,44.75 | v43,44.67 43.08,44.75
06CLK
  Top 0.5: J5.11 30.34,5.62 31.57,6.85 31.57,11.78 | 31.57,11.78 31.6,11.81 | 31.57,11.78 31.57,16.67 32.34,17.44 45.11,17.44 46.61,18.94 46.61,22.14 49.95,25.48 49.95,27.9 50.51,28.46 R352.2
06CLK_NRM
  Top 0.5: R303.2 70.12,16.06 | R314.2 70.5,15.68 70.12,16.06 | 70.12,16.06 70.12,13.75 69.22,12.85 J3.6
06CLK_PS
  Top 0.5: J2.6 122.41,54.63 122.01,54.23 122.01,53.71 121.58,53.28 114.76,53.28 113.77,52.29 R230.2 112.49,53.48 112.22,53.75 R203.2
06CLK_SUM  (via drill 0.7)
  Top 0.5: R346.1 55.09,28.47 | 13.88,40.25 J4.10 | C53.+ 55.07,28.45 55.09,28.47 | R346.1 52.41,28.42 | 52.36,28.37 R346.1 | v13.86,40.27 13.88,40.25 | 13.88,40.25 13.92,40.25 | IC13.2 54.12,32.05 54.74,31.43 55.55,31.43 55.8,31.18 55.8,29.03 55.24,28.47 55.09,28.47 | v51.18,27.03 51.65,27.5 51.83,27.5 52.2,27.87 52.2,28.31 R346.1
  Bottom 0.5: v13.86,40.27 13.92,40.27 13.94,40.25 15.95,40.25 16,40.2 16.03,40.2 16.77,39.46 16.77,28.53 18.63,26.67 42.5,26.67 42.85,27.02 42.85,28.22 43.3,28.67 45.44,28.67 45.46,28.65 46.71,28.65 46.99,28.36 46.99,27.55 47.51,27.03 v51.18,27.03
07CLK_NRM
  Top 0.5: R315.2 73.06,15.67 | R332.2 75.87,15.71 73.1,15.71 73.06,15.67 | J3.7 71.76,4.89 70.63,6.02 70.63,12.44 73.06,14.87 73.06,15.67 | R331.2 73.08,15.65 73.06,15.67
07CLK_PS
  Top 0.5: J2.7 114.7,52.09 113.51,50.9 113.51,48.92 113.38,48.79 R259.2 R260.2 | R260.2 R261.2 R262.2 R264.2 R263.2 | R260.2
07CLK_SUM  (via drill 0.7)
  Top 0.5: C54.+ 75.6,29.6 | 75.6,29.6 75.16,30.04 | R353.1 75.62,29.58 75.6,29.6 | J4.11 5.78,37.71 7.09,36.4 17.1,36.4 19.21,34.29 21.95,34.29 22.01,34.35 v22.04,34.35 | 75.6,29.6 74.72,29.6 | 74.72,29.6 71.5,29.6 71.45,29.55 v71.36,29.55 | 75.16,30.04 74.72,29.6 | v50.88,42.66 50.9,42.64 v60.93,42.64 | IC10.13 75.2,30.08 75.16,30.04
  Bottom 0.5: v22.04,34.35 23.68,35.99 23.68,41.94 24.4,42.66 v50.88,42.66 v50.87,42.65 50.77,42.65 50.79,42.63 | v71.36,29.55 69.52,29.55 68.63,30.44 68.63,40.77 68.08,41.32 65.98,41.32 64.62,42.68 60.96,42.68 60.96,42.67 v60.93,42.64
08CLK_NRM
  Top 0.5: R318.2 77.43,16.14 77.89,15.68 R333.2 R334.2 80.31,14.71 79.96,14.36 74.04,14.36 71.76,12.08 J3.8
08CLK_PS
  Top 0.5: J2.8 122.18,52.09 121.87,51.78 121.87,51.27 121.5,50.9 114.76,50.9 114.29,50.43 114.29,38.69 113.6,38 R265.2 | R265.2 R267.2 R268.2 | R268.2 R270.2 | R266.2 R265.2 | R269.2 R268.2
08CLK_SUM  (via drill 0.7)
  Top 0.5: J4.12 12.68,37.71 | 12.68,37.71 12.69,37.72 | C55.+ 26.05,46.06 v26.04,46.01 | v18.11,37.7 12.69,37.7 12.68,37.71 | C55.+ 26.1,44.64 27.21,44.64 27.59,44.26 27.59,42.61 27.19,42.21 26.44,42.21 25.75,41.52 IC11.6 | C55.+ 24.54,44.59 R354.1
  Bottom 0.5: v18.11,37.7 20.18,37.7 20.89,38.41 20.89,45.09 21.81,46.01 v26.04,46.01
09CLK  (via drill 0.7)
  Top 0.5: J5.13 32.88,5.7 34.2,7.02 34.2,15.43 | 34.2,15.43 34.14,15.49 | v34.1,15.55 34.2,15.45 34.2,15.43 | v19.22,15.47 v19.21,15.48 19.21,22.43 20.2,23.42 31.66,23.42 33.57,25.33 R361.2
  Bottom 0.5: v19.22,15.47 34.02,15.47 v34.1,15.55
09CLK_NRM
  Top 0.5: R321.2 81.81,16.24 82.37,15.68 R335.2 83.25,14.46 83.31,14.4 82.41,13.5 74.92,13.5 73.14,11.72 73.14,6 74.3,4.84 J3.9
09CLK_PS
  Top 0.5: J2.9 115.6,49.55 115.17,49.12 115.17,28.14 113.5,26.47 R271.2 112.25,27.51 111.84,27.92 R243.2
09CLK_SUM  (via drill 0.7)
  Top 0.5: 28.99,30.98 28.99,28.9 29.48,28.41 | 29.48,28.41 R355.1 | C56.+ 29.5,28.43 29.48,28.41 | J4.13 5.63,35.17 6.93,33.87 17.19,33.87 18.88,32.18 21.97,32.18 v22.03,32.12 | IC11.13 30.83,31.68 30.44,31.29 29.3,31.29 28.99,30.98 | v28.98,30.76 28.99,30.98
  Bottom 0.5: v22.03,32.12 23.88,32.12 25.24,30.76 v28.98,30.76
10CLK  (via drill 0.7)
  Top 0.5: J5.15 35.42,5.79 37.95,8.32 v37.95,15.62 | R362.2 47.72,27.06 44.29,23.63 44.29,21.35 43.49,20.55 v37.94,20.55
  Bottom 0.5: v37.95,15.62 v37.95,20.54 v37.94,20.55
10CLK_NRM
  Top 0.5: R323.2 84.74,16.22 85.29,15.67 R336.2 R337.2 87.62,12.97 87.21,12.56 75.41,12.56 74.3,11.45 J3.10
10CLK_PS
  Top 0.5: J2.10 122.32,49.55 121.05,48.28 116.62,48.28 116.12,47.78 116.12,24.1 115.12,23.1 112.26,23.1 R272.2 | R272.2 R274.2 R275.2 | R276.2 R277.2 | R273.2 R272.2 | R276.2 | R276.2 R275.2 | R275.2
10CLK_SUM  (via drill 0.7)
  Top 0.5: 43.56,28.38 R356.1 | 43.56,28.38 43.03,28.91 43.03,31.23 43.31,31.51 44.51,31.51 44.97,31.97 IC12.6 | J4.14 12.94,35.17 | 12.94,35.17 12.95,35.16 | v13.06,35.22 13.01,35.17 12.94,35.17 | v44.69,26.82 44.7,27.27 C57.+ 43.63,28.31 43.56,28.38
  Bottom 0.5: v13.06,35.22 14.55,35.22 15.32,34.45 15.32,27.3 17.23,25.39 43.94,25.39 44.68,26.13 v44.69,26.82
11CLK
  Top 0.5: J4.1 3.92,51.28 4.86,52.22 11.59,52.22 12.48,51.33 12.48,49.89 12.95,49.42 34.75,49.42 37.13,47.04 R363.2 37.09,44.68
11CLK_NRM
  Top 0.5: R326.2 89.18,16.11 89.65,15.64 R338.2 | R338.2 R339.2 92.21,15.51 92.21,12.53 91.28,11.6 76.79,11.6 75.67,10.48 75.67,6.19 76.84,5.02 J3.11 | R338.2
11CLK_PS
  Top 0.5: J2.11 117.39,47.01 117.03,46.65 117.03,14.38 116.21,13.56 112.33,13.56 R278.2 R279.2 | R283.2 R282.2 R281.2 | R279.2 112.2,10.5 R281.2 | R280.2 R279.2 | R281.2
11CLK_SUM  (via drill 0.7)
  Top 0.5: 40.23,44.7 38.65,44.7 | J4.15 3.92,30.65 4.26,30.31 11.23,30.31 11.25,30.29 v11.25,30.25 | 40.23,44.7 41.34,44.7 41.8,44.24 41.8,42.37 41.55,42.12 40.35,42.12 39.89,41.66 IC12.13 | 40.23,44.7 C58.+ | R357.1 38.65,44.7 | 38.65,44.7 v38.65,46.01
  Bottom 0.5: v11.25,30.25 11.25,44.51 12.44,45.7 19.55,45.7 21.6,47.75 27.45,47.75 29.22,45.98 38.56,45.98 38.59,46.01 v38.65,46.01
12CLK
  Top 0.5: J4.3 1.96,47.87 1.46,48.37 1.46,52.22 2.69,53.45 5.27,53.45 12.51,53.45 13.52,52.44 13.52,50.9 14.03,50.39 39.03,50.39 42.9,46.52 49.95,46.52 51.93,44.54 62.11,44.54 63.15,43.5 63.15,28.6 63.05,28.5 R364.2
12CLK_NRM
  Top 0.5: R329.2 93.64,16.11 94.11,15.64 R340.2 95.09,11.6 94.23,10.74 77.61,10.74 76.84,9.97 J3.12
12CLK_PS
  Top 0.5: J2.12 122.4,47.01 121.9,46.51 121.9,14.44 120.68,13.22 118.82,13.22 117.44,11.84 117.44,3.55 116.19,2.3 112.12,2.3 R284.2 | R284.2 | R257.2 111.76,3.8 112.09,3.47 R284.2
12CLK_SUM  (via drill 0.7)
  Top 0.5: 57.36,29.07 57.36,31.31 57.74,31.69 58.91,31.69 59.21,31.99 IC13.6 | C59.+ R358.1 | 57.36,29.07 57.93,28.5 | 12.01,32.63 J4.16 13,32.63 | 13,32.63 13.01,32.64 | v13.09,32.58 13.04,32.63 13,32.63 | 57.36,28.94 v57.36,28.43 57.36,28.26 57.6,28.5 57.93,28.5 | 57.36,28.94 57.36,29.07 | 57.93,28.5 57.36,28.94 | C59.+ | C59.+ 57.93,28.5
  Bottom 0.5: v13.09,32.58 13.09,27.16 16.13,24.12 51.23,24.12 52.17,25.06 52.17,26.12 53.09,27.04 56.91,27.04 57.36,27.49 v57.36,28.43
DELTA
  Top 0.5: R67.1 R62.2 37.18,59.48 37.05,59.61 35.25,59.61 IC3.8
GND  (via drill 0.7)
  Top 0.5: J4.2 J4.4 | IC10.10 71.39,31.3 71.84,30.85 73.56,30.85 73.93,31.22 IC10.12 73.96,34.25 74.73,35.02 74.7,36.04 74.76,36.1 | IC10.5 71.39,39.53 71.83,39.97 73.62,39.97 73.93,39.66 IC10.3 73.93,36.93 74.76,36.1 | 74.76,36.1 78.76,36.1 79.14,36.48 v79.14,38.96 | IC13.5 57.94,33.86 57.33,33.25 55.92,33.25 55.4,33.77 IC13.3 55.4,36.56 54.51,37.45 51.64,37.45 50.98,36.79 50.98,34.69 | IC12.12 41.16,40.96 41.47,41.27 | 43.36,41.27 43.7,40.93 IC12.10 43.7,38.34 44.57,37.47 | IC11.5 27.02,40.8 27.35,41.13 29.24,41.13 29.55,40.82 IC11.3 29.56,37.87 30.39,37.04 | IC12.3 41.16,32.82 41.58,32.4 43.4,32.4 43.72,32.72 43.72,34.35 IC12.5 43.7,35.33 | 30.39,37.04 33.28,37.04 33.49,36.83 33.49,31.99 | 30.39,37.04 30.58,36.85 30.54,36.34 29.56,35.36 IC11.12 29.53,34.13 29.53,32.66 29.03,32.16 27.51,32.16 27.02,32.65 IC11.10 | 44.57,37.47 47.24,37.47 47.73,36.98 v47.73,32.63 | 44.59,36.22 44.59,37.45 44.57,37.47 | R5.1 12.43,74.55 12.76,74.88 14.97,74.88 v15.36,74.49
  Top 1: J1.2 J1.4
  other vias: 5.84,81.74 6.85,76.5 5.86,71.59 26.45,77.82 26.47,71.24 25.43,93.01 16.71,81.8 16.96,66.34 11.4,49 21.76,54.06 50.88,52.95 54.32,71.32 50.84,89.53 50.28,73.7 37.19,71.62 78.15,77.87 78.49,95.09 81.77,80.52 92.17,80.57 80,55.64 79.3,33.07 50.99,34.62 33.46,31.94 24.13,18.67 36.12,13.16 28.39,18.64 30.31,12.69 88.36,95.56 123.47,86.22
  pour Top: 0.01,101.59 127.01,101.56 127.02,0.01 0,0
  pour Bottom: 0,101.59 127.02,101.57 127.01,-0.01 0.01,0
J_DELTA
  Top 0.5: IC3.14 35.25,67.23 38.18,67.23 R63.2 R64.1 36.36,68.78 35.51,69.63 35.51,73.42 36.2,74.11 38.19,74.11 R65.1
J_SIGMA  (via drill 0.7)
  Top 0.5: R61.2 39.08,81.74 38.95,81.87 IC2.8 35.75,80.9 36.33,80.32 v36.33,78.72 | R68.1 38.63,63.48 39.03,63.88 39.06,63.88 v39.11,63.93
  Bottom 0.5: v36.33,78.72 36.29,78.72 36.24,78.67 35.87,78.67 35.51,78.31 35.51,73.49 36.13,72.87 36.13,66.53 36.79,65.87 38.61,65.87 39.11,65.37 v39.11,63.93
N$1
  Top 0.5: R67.2 41.4,58.05 R72.1
N$2
  Top 0.5: R68.2 R73.1
N$4  (via drill 0.7)
  Top 0.5: 22.96,81.48 R13.2 23.04,83 v24.57,83 | 22.96,81.48 22.96,79.95 R18.2 | C3.- 22.93,81.45 22.96,81.48 | IC2.5 28.72,84.41 v27.84,85.29
  Bottom 0.5: v27.84,85.29 25.23,85.29 24.58,84.64 v24.58,83.01 v24.57,83
N$23
  Top 0.5: C46.+ 78.07,42.86 R287.1 75.83,42.86 75.57,42.6 75.57,41.94 75.23,41.6 74.59,41.6 R285.2 74.59,41.38 74.59,40.76 75.16,40.19 75.16,38.19 IC10.2
N$25
  Top 0.5: R88.1 R82.2
N$26
  Top 0.5: R265.1 R237.2
N$31
  Top 0.5: R95.1 R96.1
N$32
  Top 0.5: R96.2 51.78,54.79 C29.+
N$40
  Top 0.5: R112.1 R106.2 60.75,52.78 61.42,53.45 63.79,53.45 IC5.6
N$42
  Top 0.5: R112.2 R118.1
N$43  (via drill 0.7)
  Top 0.5: R118.2 63.04,48.75 63.81,49.52 | R124.1 75.59,52.96 | 75.59,52.96 75.59,53.22 75.21,53.6 C34.+ | v77.18,52.96 75.59,52.96 | IC5.7 63.81,49.52 | 63.81,49.52 63.81,48.58 64.68,47.71 v70.21,47.71 R148.1
  Bottom 0.5: v77.18,52.96 77.18,48.86 76.03,47.71 v70.21,47.71
N$51
  Top 0.5: R130.1 R124.2
N$60
  Top 0.5: 70.08,40.02 70.12,40.06 | R288.1 69.16,42.94 69.56,42.93 | 69.56,42.93 69.78,42.71 69.78,41.86 70.12,41.52 R286.2 70.86,40.8 70.12,40.06 | R288.1 68.82,42.95 | R288.1 C47.+ | 70.12,40.06 IC10.6 | 69.56,42.93 69.54,42.95 R288.1
N$61
  Top 0.5: R137.1 72.95,55.2 R138.1
N$62
  Top 0.5: R138.2 77.02,55.2 C41.+
N$67
  Top 0.5: R154.1 75.64,48.37 74.99,47.72 R148.2 73.03,48.31 72.49,48.85 67.4,48.85 66.95,49.3 66.95,53.1 67.3,53.45 68.99,53.45 IC5.9
N$68
  Top 0.5: R160.1 R154.2
N$72
  Top 0.5: R316.2 R331.1
N$80
  Top 0.5: R87.1 R81.2
N$88
  Top 0.5: R317.2 R332.1
N$89
  Top 0.5: R93.1 R94.1
N$95
  Top 0.5: R94.2 C28.+
N$100
  Top 0.5: R111.1 60.75,59.68 R105.2 60.73,58.98 61.18,58.53 63.79,58.53 IC5.2
N$121
  Top 0.5: R111.2 R117.1
N$126  (via drill 0.7)
  Top 0.5: 75.62,59.13 75.62,58.78 75.29,58.45 74.55,58.45 C38.+ | 75.62,59.13 R123.1 | v69.7,64.18 69.54,64.1 | v77.07,59.14 75.63,59.14 75.62,59.13 | IC5.1 63.81,62.55 | 63.81,62.55 63.81,63.21 64.7,64.1 69.62,64.1 v69.7,64.18 | 63.81,62.55 63.79,62.57 R117.2 | v69.7,64.18 69.73,64.21 R147.1
  Bottom 0.5: v69.7,64.18 76.45,64.1 77.07,63.48 v77.07,59.14
N$130
  Top 0.5: R129.1 R123.2
N$145
  Top 0.5: R319.2 R333.1
N$146
  Top 0.5: R266.1 109.85,36.55 R238.2
N$148
  Top 0.5: R135.1 R136.1
N$153
  Top 0.5: R136.2 C40.+
N$161
  Top 0.5: R153.1 75.59,63.57 74.95,64.21 R147.2 72.91,63.59 72.44,63.1 67.72,63.1 67.09,62.43 67.09,58.99 67.55,58.53 68.99,58.53 IC5.13
N$168
  Top 0.5: R159.1 74.18,62.04 R153.2
N$170
  Top 0.5: R90.1 R84.2
N$179
  Top 0.5: R320.2 R334.1
N$184
  Top 0.5: R16.1 20.46,90.84 R17.1
N$185
  Top 0.5: R8.2 21.64,87.52 R12.1
N$186
  Top 0.5: R17.2 17.67,90.82 C7.-
N$187
  Top 0.5: C1.+ R6.1 13.79,76.9 | R2.2 R1.2 13.79,76.9 | 13.8,76.89 13.79,76.9 | IC1.2 15.25,76.51 14.86,76.9 13.79,76.9
N$188
  Top 0.5: R6.2 C1.- 12.39,81.29 12.8,81.7 14.81,81.7 | R9.1 18.8,81.88 19.23,81.45 C3.+ | R8.1 18.79,88.86 19.16,89.23 C6.+ | IC1.1 15.69,77.78 14.81,78.66 14.81,81.7 | 14.81,81.7 14.81,82.68 15.21,83.07 R9.1 | R8.1 R9.1 | R8.1 R24.1 R26.1
N$189  (via drill 0.7)
  Top 0.5: R16.2 23.11,89.25 | 23.11,89.25 R12.2 24.65,87.45 v24.67,87.47 | C6.- 23.09,89.23 23.11,89.25 | IC2.3 28.67,86.95 v28.39,86.79
  Bottom 0.5: v28.39,86.79 25.35,86.79 v24.67,87.47
N$190
  Top 0.5: C2.+ R7.1 13.82,69.65 R4.2 14.89,70.78 15.54,71.43 IC1.6
N$191
  Top 0.5: IC4.2 41.14,76.85 40.97,77.02 R74.1 | R74.1 39.77,77.02 | C19.+ 39.61,78.51 R66.2 39.61,76.99 R74.1
N$192
  Top 0.5: R32.1 26.02,88.1 R28.2
N$193
  Top 0.5: R24.2 26.54,86.05 27.33,86.84 R28.1 | R28.1 27.4,88.08 28.7,88.08 28.84,88.22 IC2.2 | 27.44,88.06 R28.1
N$194
  Top 0.5: R14.1 20.64,60.69 R10.2
N$195
  Top 0.5: C11.+ 30.35,93.88 29.93,93.46 R36.1 R52.1 27.65,90.82 27.42,90.59 R32.2 29.22,89.54 29.27,89.49 IC2.1
N$196  (via drill 0.7)
  Top 0.5: J1.1 3.26,84.68 3.56,84.98 9.94,84.98 11.04,83.88 11.04,77.4 11.09,77.35 v11.09,77.52 12.28,77.52 R1.1 | v10.95,71.08 11.25,70.78 R4.1
  Bottom 0.5: v11.09,77.52 11.09,72.68 10.9,72.49 10.9,71.13 v10.95,71.08
N$197
  Top 0.5: R36.2 31.35,92.24 R40.1
N$198
  Top 0.5: 11.11,73.98 11.07,74.02 6.58,74.02 5.65,74.95 5.65,79.89 5.18,80.36 J1.3 | R3.1 11.62,72.23 11.11,72.74 11.11,73.98 | R2.1 11.57,75.96 11.11,75.5 11.11,73.98
N$199
  Top 0.5: C11.- 33.9,93.88 34.17,93.61 | 34.17,93.61 R40.2 | R40.2 | 34.17,93.61 34.17,95.32 R44.2 | R40.2 34.19,92.23 34.19,91.06 33.77,90.64 33.77,87.6 34.42,86.95 IC2.12
N$200
  Top 0.5: R5.2 13.79,72.54 R3.2 14.85,72.23 15.32,72.7 IC1.5
N$201
  Top 0.5: R44.1 R45.1
N$202
  Top 0.5: R45.2 28.68,95.53 C15.-
N$203  (via drill 0.7)
  Top 0.5: 37.76,88.07 v37.8,88.03 | R52.2 32.6,90.82 v32.67,90.75 | R56.1 37.97,87.86 v37.8,88.03 | v37.8,88.03 37.63,88.2 IC2.13
  Bottom 0.5: v37.8,88.03 37.8,89.89 36.94,90.75 v32.67,90.75
N$204
  Top 0.5: R60.1 R56.2
N$205
  Top 0.5: R99.1 R100.1
N$206
  Top 0.5: R9.2 R13.1
N$208
  Top 0.5: R18.1 20.29,79.86 R19.1
N$209
  Top 0.5: C8.- R19.2
N$210
  Top 0.5: R26.2 26.96,84.56 27.47,84.05 27.47,83.1 | 27.47,83.1 R29.1 | 27.47,83.1 27.59,82.98 27.64,83.03 28.48,83.03 28.59,83.14 IC2.6
N$211
  Top 0.5: R29.2 R33.1
N$212
  Top 0.5: 27.52,81.71 R33.2 | R33.2 27.43,80.6 28.01,80.02 R53.1 R37.1 30.01,77.58 30.6,76.99 C12.+ | IC2.7 29.11,81.87 28.86,81.62 R33.2
N$213
  Top 0.5: R37.2 R41.1
N$214
  Top 0.5: 34.21,77.05 R41.2 34.21,80.92 33.71,81.42 33.71,83.75 34.37,84.41 IC2.10 | 34.21,77.05 R46.2 | C12.- 34.15,76.99 34.21,77.05
N$215
  Top 0.5: R46.1 31.48,75.4 R47.1
N$216
  Top 0.5: R47.2 28.55,75.38 C16.-
N$217  (via drill 0.7)
  Top 0.5: R57.1 37.91,83.27 v37.83,83.22 37.78,83.14 IC2.9 | R53.2 32.62,80.02 v32.77,80.17
  Bottom 0.5: v37.83,83.22 37.83,80.48 37.52,80.17 v32.77,80.17
N$218
  Top 0.5: R57.2 R61.1
N$219
  Top 0.5: R322.2 R335.1
N$220  (via drill 0.7)
  Top 0.5: R14.2 23.44,59.03 | R20.2 23.44,58.76 | C4.- 23.44,59.03 | 28.05,62.15 28.04,62.14 | 23.44,58.76 23.44,59.03 | v23.42,59.05 23.42,58.78 23.44,58.76 | v28.01,62.14 v28.02,62.15 28.05,62.15 | IC3.5 30.01,62.15 28.05,62.15
  Bottom 0.5: v23.42,59.05 23.42,61.51 24.05,62.14 v28.01,62.14
N$221
  Top 0.5: R20.1 R21.1
N$222
  Top 0.5: R21.2 17.63,57.4 C9.-
N$223
  Top 0.5: R25.2 26.42,62.12 26.97,61.57 R30.1 27.06,60.88 27.08,60.86 IC3.6
N$224
  Top 0.5: R30.2 R34.1
N$225
  Top 0.5: C13.+ 30.32,54.99 29.93,55.38 R38.1 R54.1 29.9,58.06 27.36,58.06 26.98,58.44 R34.2 27.68,59.36 27.93,59.61 30.01,59.61 IC3.7
N$226
  Top 0.5: R38.2 R42.1
N$227  (via drill 0.7)
  Top 0.5: R42.2 34.03,55.01 | 34.03,55.01 34.03,53.42 R48.2 | C13.- 34.01,54.99 | 34.01,54.99 34.03,55.01 | 37.07,62.15 37.08,62.14 | v37.14,62.19 37.11,62.19 37.07,62.15 | v33.96,55.04 34.01,54.99 | IC3.10 37.05,62.13 37.07,62.15
  Bottom 0.5: v33.96,55.04 36.67,55.04 37.15,55.52 37.14,55.53 v37.14,62.19
N$228
  Top 0.5: R48.1 R49.1
N$229
  Top 0.5: R49.2 28.38,53.4 C17.-
N$230
  Top 0.5: R54.2 32.36,58.09 32.95,58.68 32.95,60.41 33.4,60.86 IC3.9 35.25,60.88 37.59,60.88 37.65,60.94 38.61,60.94 R58.1
N$231
  Top 0.5: R58.2 R62.1
N$232
  Top 0.5: R100.2 C31.+
N$233
  Top 0.5: R15.1 21.97,65.03 R11.2
N$234  (via drill 0.7)
  Top 0.5: R22.2 23.33,66.63 | 23.33,66.63 23.33,65.07 R15.2 | C5.- 21.88,66.63 v23.32,66.63 | v23.31,66.62 v23.32,66.63 | v23.32,66.63 23.33,66.63 | v28.06,64.67 28.08,64.69 28.1,64.67 IC3.3
  Bottom 0.5: v23.31,66.62 23.31,65.54 24.17,64.68 v28.05,64.68 v28.06,64.67
N$235
  Top 0.5: R23.1 R22.1
N$236
  Top 0.5: C10.- 19.11,68.16 R23.2
N$237
  Top 0.5: R27.2 26.11,63.59 26.79,64.27 R31.1 | 26.96,65.97 R31.1 | IC3.2 27.74,65.94 27.54,65.74 26.85,65.74 R31.1
N$238
  Top 0.5: R35.1 R31.2
N$239
  Top 0.5: C14.+ 30.37,71.95 30.07,71.65 R39.1 R55.1 27.26,68.8 26.8,68.34 R35.2 26.87,67.21 IC3.1
N$240
  Top 0.5: R43.1 R39.2
N$241  (via drill 0.7)
  Top 0.5: R50.2 34.2,71.98 | 34.2,71.98 34.2,71.9 | 34.2,71.9 34.2,70.56 R43.2 | C14.- 34.16,71.94 | 34.16,71.94 34.2,71.9 | 34.2,71.98 34.16,71.94 | v34.18,71.99 v34.19,71.99 34.2,71.98 | IC3.12 37.18,64.67 v37.26,64.75
  Bottom 0.5: v34.18,71.99 34.7,71.99 35.16,71.53 35.16,65.38 35.79,64.75 v37.26,64.75
N$242
  Top 0.5: R50.1 31.47,73.62 R51.1
N$243
  Top 0.5: R51.2 28.59,73.6 C18.-
N$244
  Top 0.5: R55.2 32.24,68.79 32.68,68.35 32.68,66.61 33.33,65.96 35.21,65.96 IC3.13 35.25,65.96 37.08,65.96 37.18,65.86 38.26,65.86 R59.1
N$245
  Top 0.5: R63.1 R59.2
N$246
  Top 0.5: R114.1 R108.2 61.21,68.53 61.77,69.09 61.77,70.93 62.14,71.3 IC6.6
N$247
  Top 0.5: R7.2 C2.- 12.42,67 12.9,66.52 14.55,66.52 | 15.03,66.92 14.59,66.48 | 14.59,66.48 14.55,66.52 | R11.1 R27.1 R25.1 R10.1 19.21,59.58 19.76,59.03 C4.+ | R11.1 15.72,65.03 15.03,65.72 15.03,66.04 | 15.03,66.04 15.03,66.53 | 15.03,66.53 15.03,66.92 | 14.55,66.52 14.56,66.53 15.03,66.53 | 14.59,66.48 15.03,66.04 | R11.1 19.2,66.28 19.57,66.65 C5.+ | IC1.7 15.71,70.16 15.03,69.48 15.03,66.92
N$249
  Top 0.5: R64.2 39.68,70.21 R71.1
N$250
  Top 0.5: R69.2 R65.2 40.34,74.11 40.63,74.4 40.63,75.12 41.07,75.56 42.07,75.56 42.09,75.58 IC4.3
N$251
  Top 0.5: 42.45,78.2 R77.1 42.45,80.4 42.24,80.19 38.92,80.19 38.14,79.41 C19.- 38.18,78.54 R74.2 | 42.45,78.2 42.45,78.18 | IC4.1 42.45,78.2
N$252  (via drill 0.7)
  Top 0.5: 48.25,76.88 48.28,76.85 | 45.54,79.36 45.54,77.38 46.09,76.83 47.55,76.83 IC4.13 48.28,76.85 | 45.54,79.36 45.54,90.14 44.91,90.77 R70.2 | R71.2 38.27,71.03 38.69,71.45 v40.04,71.45 | v45.57,80.11 45.57,79.39 45.54,79.36 | 48.28,76.85 48.31,76.82 49.29,76.82 R75.1 49.33,75.75 49.95,75.13 51.5,75.13 51.75,75.38 51.75,79.72 51.57,79.9 C21.+
  Bottom 0.5: v45.57,80.11 42.52,80.11 42.45,80.18 41.52,79.25 41.52,72.15 40.82,71.45 v40.04,71.45
N$253
  Top 0.5: R75.2 50.73,78.29 R78.1
N$254
  Top 0.5: R267.1 R239.2
N$255
  Top 0.5: 49.19,78.15 R78.2 | C21.- R78.2 | R78.2 49.14,78.1 | IC4.14 49.16,78.12 R78.2 | R80.1 C21.- | C21.-
N$256
  Top 0.5: R72.2 R73.2 45.07,62.41 45.73,63.07 45.73,71.37 46.11,71.75 47.55,71.75 IC4.9 47.59,71.75 50.33,71.75 50.66,71.42 C20.+ | C20.+ R76.1 | C20.+
N$257
  Top 0.5: R268.1 R240.2
N$258
  Top 0.5: R324.2 R336.1
N$259
  Top 0.5: IC4.8 C20.- 49.26,69.08 49.27,69.07 | R79.1 49.27,69.07 | R76.2 49.26,69.06 49.27,69.07
N$260
  Top 0.5: R114.2 R120.1
N$261  (via drill 0.7)
  Top 0.5: R120.2 63.72,65.66 | R126.1 75.43,70.86 | 75.43,71.14 75.43,70.86 | 70,65.59 R150.1 69.8,65.65 v69.7,65.55 69.57,65.55 69.53,65.59 70,65.59 | 75.43,70.86 75.46,70.89 v76.88,70.89 75.68,70.89 75.43,71.14 | 63.7,70.01 IC6.7 63.67,65.71 63.72,65.66 | 63.72,65.66 69.93,65.66 70,65.59 | C36.+ 75.15,71.42 75.43,71.14
  Bottom 0.5: v69.7,65.55 76.29,65.55 76.9,66.16 76.9,70.87 v76.88,70.89
N$262
  Top 0.5: R126.2 R132.1
N$263
  Top 0.5: R269.1 109.86,32.17 R241.2
N$264
  Top 0.5: R141.1 R142.1
N$265
  Top 0.5: R142.2 C43.+
N$266
  Top 0.5: 75.44,67.02 R156.1 75.44,65.98 75.11,65.65 R150.2 72.88,66.3 72.52,66.73 67.81,66.73 67.04,67.43 67.02,67.43 67,70.75 67.55,71.3 IC6.9
N$267
  Top 0.5: R162.1 74.02,67.78 R156.2
N$268
  Top 0.5: R325.2 R337.1
N$269
  Top 0.5: R83.2 59.36,78.16 R89.1
N$270
  Top 0.5: R270.1 109.88,30.72 R242.2
N$271
  Top 0.5: R97.1 R98.1
N$272
  Top 0.5: R172.1 80.6,53.06 80.83,53.29 81.72,53.29 81.73,53.28 81.99,53.54 R166.2 82.05,54.3 82.64,54.3 83.36,53.58 85.09,53.58 IC8.6
N$273
  Top 0.5: R98.2 55.22,74.95 C30.+
N$274
  Top 0.5: R113.1 R107.2 | R107.2 | R107.2 60.84,79.58 61.22,79.58 61.74,79.06 61.74,77.11 62.47,76.38 62.48,76.39 IC6.2
N$275
  Top 0.5: R113.2 59.43,82.43 R119.1
N$276  (via drill 0.7)
  Top 0.5: R119.2 63.07,82.46 63.66,81.87 | 63.66,81.87 63.66,81.39 | 63.66,81.39 63.66,77.73 | C35.+ 75.04,76.32 75.32,76.6 75.32,76.92 | 75.32,76.92 R125.1 | R149.1 66.42,82.24 | 66.42,82.24 65.81,81.63 63.9,81.63 63.66,81.39 | v76.86,76.91 75.33,76.91 75.32,76.92 | v67.77,82.26 66.44,82.26 66.42,82.24 | 63.66,81.87 63.67,81.86 IC6.1
  Bottom 0.5: v67.77,82.26 76.15,82.26 76.85,81.56 v76.85,76.92 v76.86,76.91
N$277
  Top 0.5: R131.1 R125.2
N$278
  Top 0.5: R327.2 R338.1
N$279
  Top 0.5: R140.1 73.98,74.7 R139.1
N$280
  Top 0.5: R140.2 C42.+
N$281
  Top 0.5: R155.1 75.31,81.75 74.82,82.24 R149.2 72.58,81.53 72.2,81.15 67.34,81.15 67.02,80.83 67.02,76.91 67.55,76.38 IC6.13
N$282
  Top 0.5: R155.2 73.89,80.04 72.7,80.04 R161.1
N$288
  Top 0.5: R271.1 R244.2
N$289
  Top 0.5: R171.1 80.59,59.16 80.83,58.92 81.7,58.92 82.01,58.61 R165.2 82.68,57.84 83.5,58.66 85.09,58.66 IC8.2
N$291
  Top 0.5: R92.1 54.53,88.12 R86.2
N$292
  Top 0.5: 57.2,89.68 R103.2 58.74,91.33 59.25,90.82 IC7.5 | 57.2,89.68 R92.2 | C27.- 57.17,89.71 57.2,89.68
N$293
  Top 0.5: R104.1 R103.1
N$294
  Top 0.5: R104.2 51.68,91.32 C33.+
N$295
  Top 0.5: 61.08,89.56 61.07,89.55 | R116.1 60.73,89.21 | IC7.6 61.07,89.55 | 61.07,89.55 60.73,89.21 | R110.2 60.72,89.2 60.73,89.21
N$296
  Top 0.5: R116.2 R122.1
N$297  (via drill 0.7)
  Top 0.5: R122.2 62.89,85.22 | 62.89,85.22 63.51,85.84 | R152.1 65.8,83.67 | 65.8,83.67 64.21,83.67 63.59,84.29 | 63.59,84.29 63.51,84.37 63.51,84.76 | 63.51,84.76 63.51,85.84 | 62.89,85.22 63.05,85.22 63.51,84.76 | v76.81,88.89 75.31,88.89 75.15,89.05 | v66.44,83.68 65.81,83.68 65.8,83.67 | 63.51,85.84 63.59,85.92 IC7.7 63.59,84.29 | 75.15,87.88 R128.1 75.15,89.05 | 75.15,89.05 74.62,89.58 C37.+
  Bottom 0.5: v76.81,88.89 76.81,84.41 76.12,83.72 66.48,83.72 v66.44,83.68
N$298
  Top 0.5: R134.1 72.52,88.05 R128.2
N$299
  Top 0.5: R231.2 R259.1
N$300
  Top 0.5: R145.1 R146.1
N$301
  Top 0.5: R146.2 75.19,91.16 C45.+
N$302
  Top 0.5: R158.1 75.21,85.7 75.21,84.13 74.75,83.67 R152.2 72.57,84.23 72.04,84.76 70.99,84.76 67.14,84.74 66.49,85.39 66.49,89.11 66.94,89.56 IC7.9
N$303
  Top 0.5: R164.1 73.74,85.84 R158.2
N$304
  Top 0.5: R328.2 R339.1
N$305
  Top 0.5: R232.2 R260.1
N$306
  Top 0.5: IC9.13 91.21,83.05 91.98,82.28 R170.2 92.51,82.88 92.9,83.27 93.21,83.27 93.3,83.36 93.6,83.36 93.83,83.59 R176.1
N$307
  Top 0.5: R261.1 R233.2
N$308
  Top 0.5: R91.1 R85.2
N$309
  Top 0.5: R330.2 R340.1
N$310
  Top 0.5: R101.1 R102.1
N$311
  Top 0.5: R102.2 C32.+
N$312
  Top 0.5: IC7.2 61.49,94.64 60.86,95.27 R109.2 R115.1
N$313
  Top 0.5: R115.2 R121.1
N$314  (via drill 0.7)
  Top 0.5: C39.+ 74.8,94.31 75.14,94.65 75.14,95.1 | 75.14,95.1 R127.1 | v76.76,95.1 75.14,95.1 | IC7.1 63.59,99.25 | 63.59,99.25 63.54,99.2 R121.2 | 63.59,99.25 64.21,99.87 v66.52,99.87 66.77,100.12 70.83,100.12 R151.1
  Bottom 0.5: v76.76,95.1 76.76,99.17 76.06,99.87 v66.52,99.87
N$315
  Top 0.5: R133.1 R127.2
N$316
  Top 0.5: R262.1 R234.2
N$317
  Top 0.5: R143.1 72.48,92.72 R144.1
N$318
  Top 0.5: R144.2 76.5,92.72 C44.+
N$319
  Top 0.5: R157.1 75.16,99.57 74.52,100.21 R151.2 72.32,99.32 72.1,99.1 67.7,99.1 66.5,97.9 66.5,95.07 66.93,94.64 IC7.13
N$320
  Top 0.5: R163.1 R157.2
N$321
  Top 0.5: R263.1 R235.2
N$322
  Top 0.5: R175.1 93.87,77.57 93.72,77.72 92.66,77.72 92.45,77.93 R169.2 91.87,78.81 91.03,77.97 91.02,77.98 IC9.9
N$323
  Top 0.5: R264.1 R236.2
N$324
  Top 0.5: R251.2 R278.1
N$325
  Top 0.5: R279.1 R252.2
N$326
  Top 0.5: R280.1 109.54,10.55 R253.2
N$327
  Top 0.5: R281.1 109.55,9.1 R254.2
N$328
  Top 0.5: R282.1 109.55,7.63 R255.2
N$329
  Top 0.5: R256.2 R283.1
N$330
  Top 0.5: R284.1 R258.2
N$331
  Top 0.5: R272.1 R245.2
N$332
  Top 0.5: R273.1 R246.2
N$333
  Top 0.5: R274.1 R247.2
N$334
  Top 0.5: R275.1 R248.2
N$335
  Top 0.5: R249.2 R276.1
N$336
  Top 0.5: R277.1 R250.2
N$338
  Top 0.5: R174.1 80.74,77.28 81,77.54 81.91,77.54 82.12,77.75 R168.2 82.7,78.65 83.38,77.97 IC9.6
N$354
  Top 0.5: R173.1 80.78,84.07 80.78,84.02 81.27,83.53 81.93,83.53 82.15,83.31 R167.2 82.72,82.44 83.33,83.05 IC9.2
N$360
  Top 0.5: R183.2 R211.1
N$361
  Top 0.5: R212.1 109.87,88.05 R184.2
N$366
  Top 0.5: R185.2 R213.1
N$367
  Top 0.5: R214.1 R186.2
N$372
  Top 0.5: R187.2 R215.1
N$373
  Top 0.5: R216.1 R188.2
N$379
  Top 0.5: R217.1 R190.2
N$385
  Top 0.5: R205.1 R177.2
N$386
  Top 0.5: R178.2 111.26,98.24 R206.1
N$391
  Top 0.5: R207.1 R179.2
N$392
  Top 0.5: R180.2 R208.1
N$397
  Top 0.5: R209.1 R181.2
N$398
  Top 0.5: R182.2 R210.1
N$404
  Top 0.5: R197.2 R224.1
N$405
  Top 0.5: R225.1 R198.2
N$410
  Top 0.5: R199.2 R226.1
N$411
  Top 0.5: R227.1 R200.2
N$416
  Top 0.5: R201.2 R228.1
N$417
  Top 0.5: R229.1 R202.2
N$423
  Top 0.5: R230.1 R204.2
N$431
  Top 0.5: R191.2 R218.1
N$432
  Top 0.5: R192.2 R219.1
N$437
  Top 0.5: R193.2 111.28,71.33 R220.1
N$438
  Top 0.5: R221.1 110.02,69.91 R194.2
N$443
  Top 0.5: R195.2 R222.1
N$444
  Top 0.5: R223.1 R196.2
N$447
  Top 0.5: 68.81,30.95 R341.2 | R347.1 R341.2 | R341.2 | C48.- 68.68,30.84 R341.2 | IC10.8 68.85,30.99 R341.2
N$450
  Top 0.5: C49.- R348.1 32.08,43.26 R342.2 32.1,43.2 IC11.1
N$453
  Top 0.5: C50.- R343.2 | R343.2 R349.1 | IC11.8 24.48,29.79 R343.2
N$456
  Top 0.5: R344.2 38.62,29.72 37.24,29.72 R350.1 37.22,29.7 38.68,29.7 | C51.- 38.68,29.7 | IC12.1 38.62,29.76 38.68,29.7
N$459
  Top 0.5: 46.24,43.23 R345.2 | R345.2 C52.- | R351.1 R345.2 | IC12.8 46.24,43.21 R345.2
N$462
  Top 0.5: C53.- 52.4,29.85 52.39,29.86 | R352.1 52.39,29.86 | 52.39,29.86 52.38,29.87 R346.2 52.36,31.75 52.86,32.25 IC13.1
N$465
  Top 0.5: 76.47,31 C54.- 78.07,30.97 R359.1 | 76.47,31 R353.2 | 76.43,31.04 76.47,31 | IC10.14 76.47,31
N$468
  Top 0.5: 24.45,43.24 R354.2 IC11.7 | 23.1,43.19 R360.1 23.05,43.24 24.45,43.24 | C55.- 24.5,43.19 24.45,43.24
N$471
  Top 0.5: R361.1 33.55,29.83 32.19,29.83 | 32.19,29.83 C56.- | 32.07,29.95 32.19,29.83 | IC11.14 32.1,31.89 32.19,31.8 32.19,29.83 | R355.2 32.17,29.81 32.19,29.83
N$474
  Top 0.5: 46.24,29.82 R356.2 | C57.- 44.77,29.78 R356.2 | R356.2 46.31,29.78 | 46.31,29.78 R362.1 | IC12.7 46.24,29.85 46.31,29.78
N$477
  Top 0.5: 38.62,43.17 R357.2 38.55,43.24 R363.1 38.65,43.24 | C58.- 38.65,43.24 | IC12.14 38.62,43.21 38.65,43.24
N$480
  Top 0.5: R358.2 | C59.- R358.2 | R358.2 R364.1 | IC13.7 R358.2
N$482
  Top 0.5: R291.2 52.33,17.07 R306.1
N$487
  Top 0.5: R290.2 R305.1
N$501
  Top 0.5: R293.2 R307.1
N$503
  Top 0.5: R294.2 R308.1
N$519
  Top 0.5: R309.1 R296.2
N$535
  Top 0.5: R298.2 R310.1
N$537
  Top 0.5: R299.2 R311.1
N$541  (via drill 0.7)